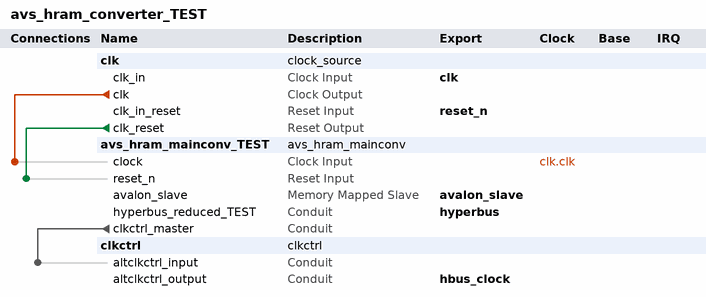
[diagram p0: system contents]
# Platform Designer (Qsys) system avs_hram_converter_TEST, Cyclone 10 LP 10CL006YE144A7G
# Parameters at their usual value, and those the tool derives, are not listed.
package require -exact qsys 22.1
create_system avs_hram_converter_TEST
set_project_property DEVICE_FAMILY {Cyclone 10 LP}
set_project_property DEVICE 10CL006YE144A7G

add_instance clk clock_source 22.1
set_instance_parameter_value clk clockFrequency 50000000

add_instance avs_hram_mainconv_TEST avs_hram_mainconv 1.0
set_instance_parameter_value avs_hram_mainconv_TEST drive_strength 0

add_instance clkctrl clkctrl 1.0

# connections
add_connection clk.clk avs_hram_mainconv_TEST.clock clock
add_connection clk.clk_reset avs_hram_mainconv_TEST.reset_n reset
add_connection avs_hram_mainconv_TEST.clkctrl_master clkctrl.altclkctrl_input conduit

# exported interfaces
add_interface avalon_slave avalon slave
set_interface_property avalon_slave EXPORT_OF avs_hram_mainconv_TEST.avalon_slave
add_interface clk clock sink
set_interface_property clk EXPORT_OF clk.clk_in
add_interface hbus_clock conduit end
set_interface_property hbus_clock EXPORT_OF clkctrl.altclkctrl_output
add_interface hyperbus conduit end
set_interface_property hyperbus EXPORT_OF avs_hram_mainconv_TEST.hyperbus_reduced_TEST
add_interface reset_n reset sink
set_interface_property reset_n EXPORT_OF clk.clk_in_reset

set_interconnect_requirement {$system} qsys_mm.clockCrossingAdapter HANDSHAKE
set_interconnect_requirement {$system} qsys_mm.enableEccProtection FALSE
set_interconnect_requirement {$system} qsys_mm.insertDefaultSlave FALSE
set_interconnect_requirement {$system} qsys_mm.maxAdditionalLatency 1

save_system avs_hram_converter_TEST.qsys
